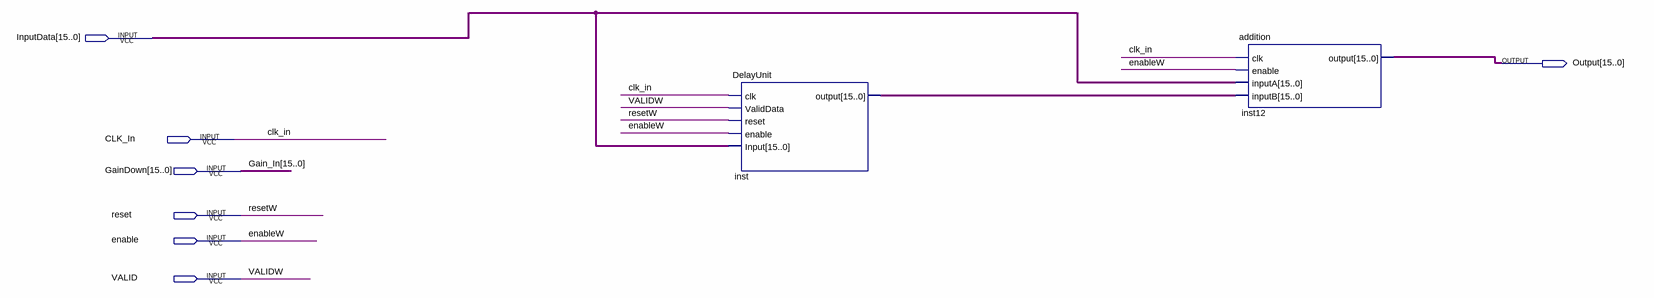
[diagram p0: schematic sheet]
// Quartus schematic echoSimple.bdf as structural Verilog: 2 symbols, 7 pins
module echoSimple (
  input  [15:0] InputData,
  input  CLK_In,
  input  [15:0] GainDown,
  input  reset,
  input  enable,
  input  VALID,
  output [15:0] Output
);

  wire [15:0] inst_output;

  DelayUnit inst (
    .clk(CLK_In), .ValidData(VALID), .reset(reset), .enable(enable), .Input(InputData), .\output (inst_output));
  addition inst12 (.clk(CLK_In), .enable(enable), .inputA(InputData), .inputB(inst_output), .\output (Output));

  // Other names for the same wires on the sheet: enableW = enable; Gain_In[15:0] = GainDown; resetW = reset;
  //   VALIDW = VALID
endmodule
